# Altium project 4th_4G.PrjPcb
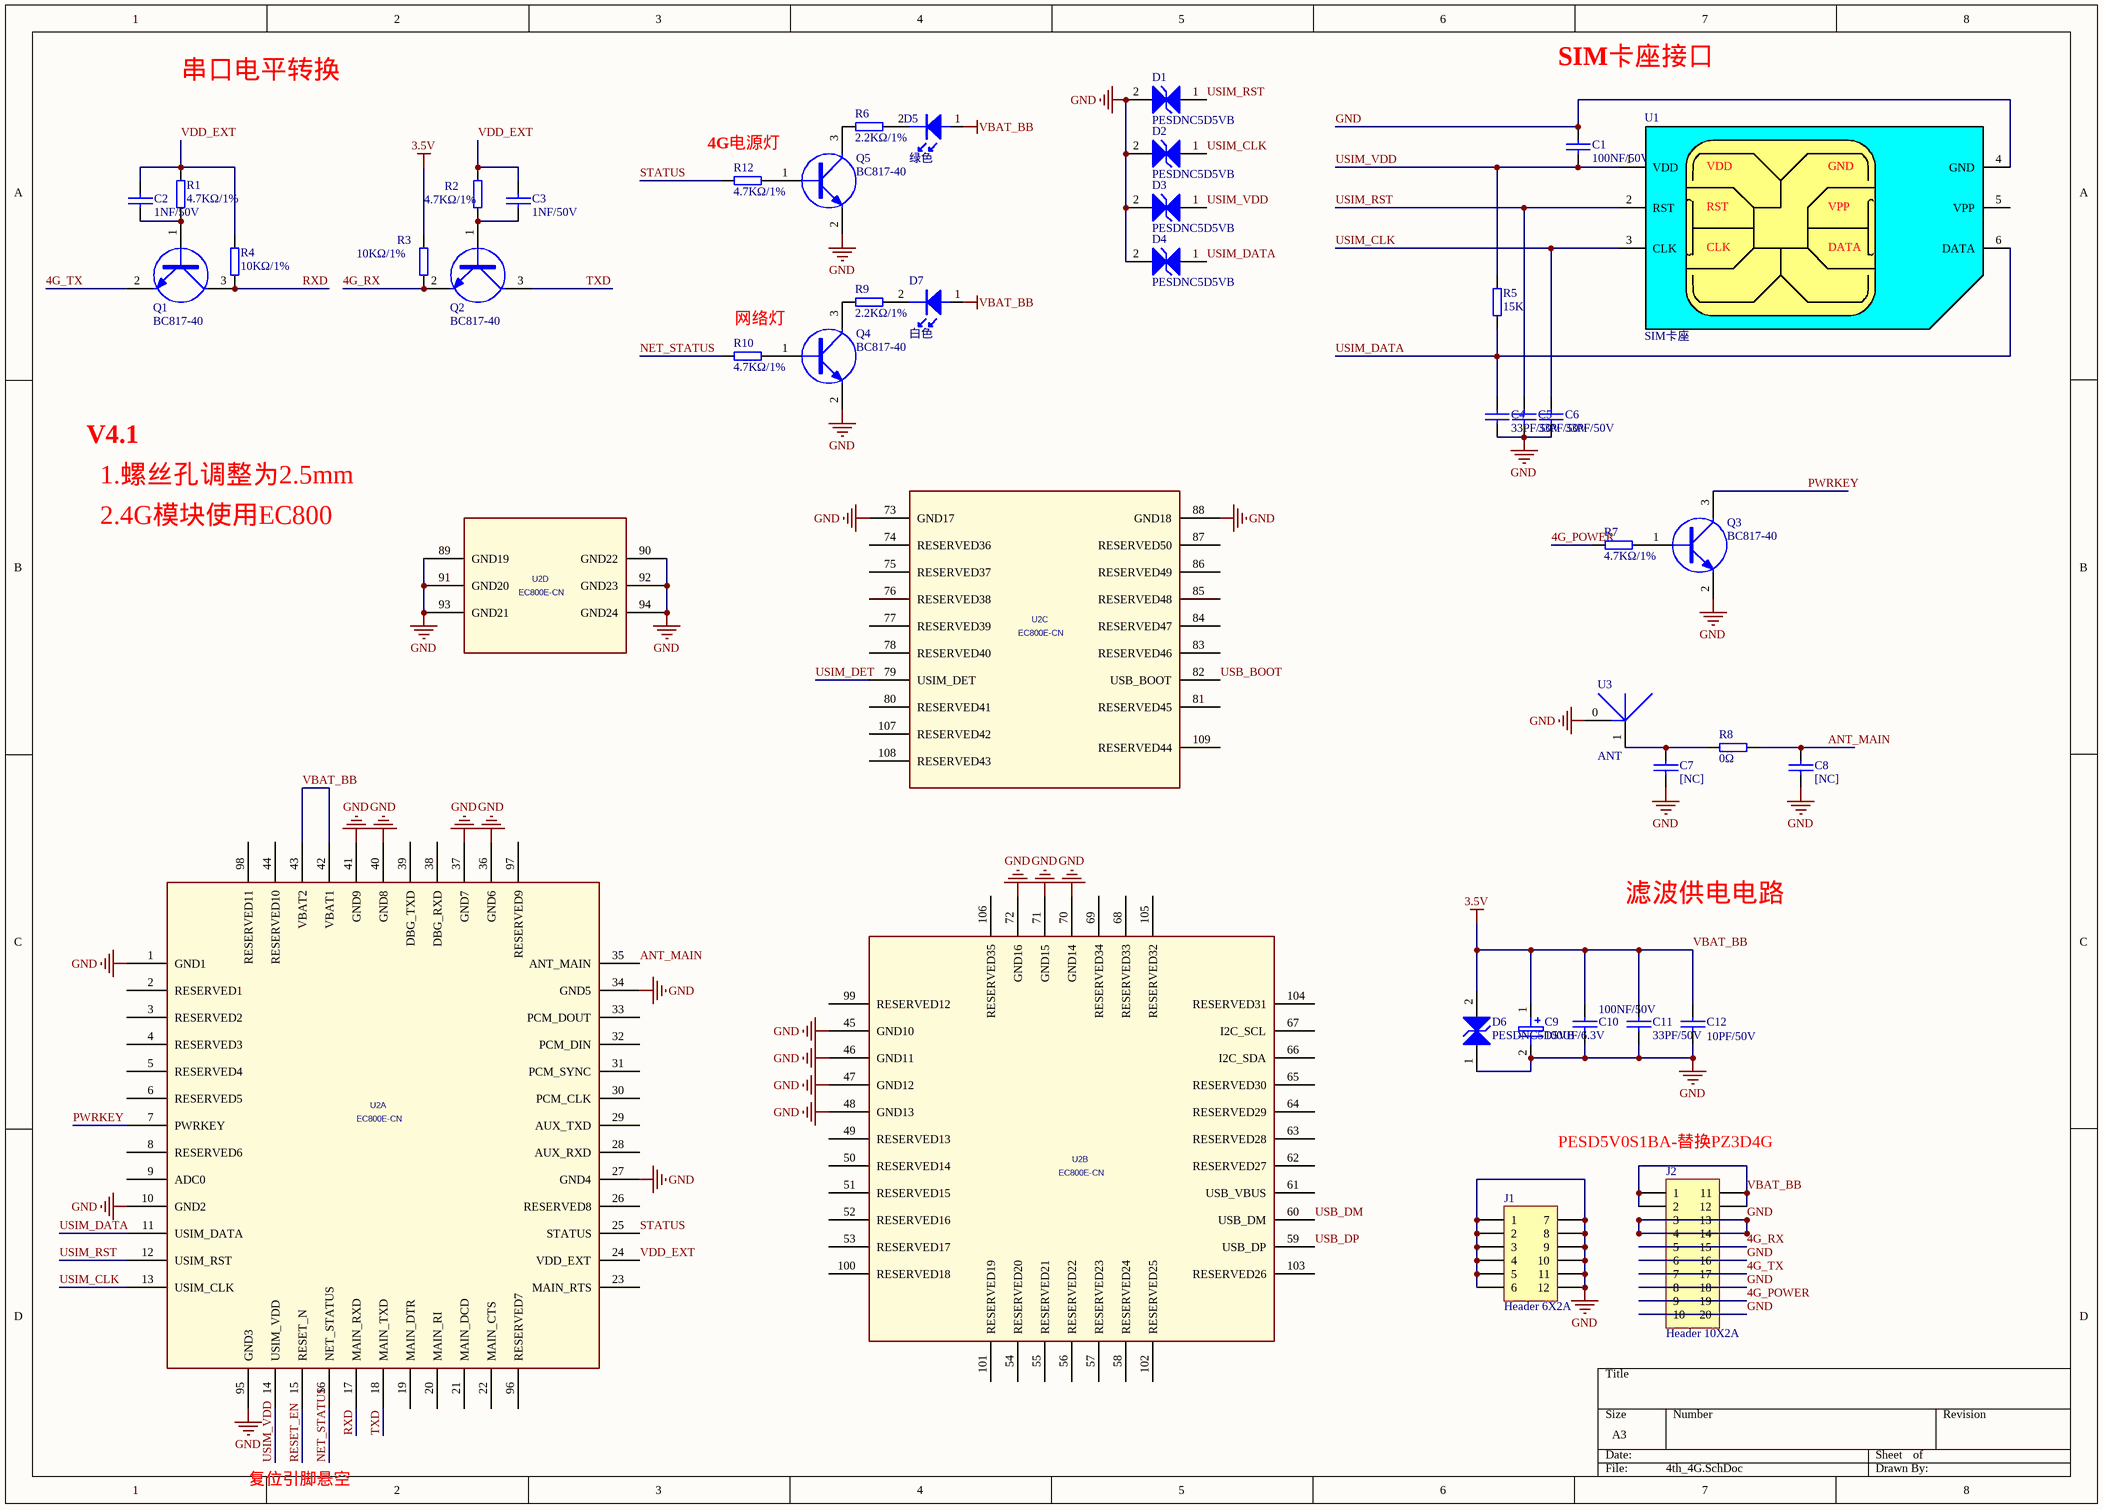
[diagram p0: 4th_4G.SchDoc]
1 sheet, 40 parts. Net scope: global (net labels, ports and power ports of the same name join across sheets).
Board file: 4th_4G.PcbDoc

## Sheet 4th_4G.SchDoc
size A3

### Parts
C1  100NF/50V  [0603_C]
C2  1NF/50V  [0603_C]
C3  1NF/50V  [0603_C]
C4  33PF/50V  [0603_C]
C5  33PF/50V  [0603_C]
C6  33PF/50V  [0603_C]
C7  [NC]  [0603_C]
C8  [NC]  [0603_C]
C9  100UF/6.3V  [CASE-B_3528]
C10  100NF/50V  [0603_C]
C11  33PF/50V  [0603_C]
C12  10PF/50V  [0603_C]
D1  PESDNC5D5VB  [SOD-523]
D2  PESDNC5D5VB  [SOD-523]
D3  PESDNC5D5VB  [SOD-523]
D4  PESDNC5D5VB  [SOD-523]
D5  绿色  [0603_D]
D6  PESDNC5D5VB  [SOD-523]
D7  白色  [0603_D]
J1  Header 6X2A  [HDR2X6_CEN]
J2  Header 10X2A  [HDR2X10_CEN]
Q1  BC817-40  [SOT-23-3]
Q2  BC817-40  [SOT-23-3]
Q3  BC817-40  [SOT-23-3]
Q4  BC817-40  [SOT-23-3]
Q5  BC817-40  [SOT-23-3]
R1  4.7KΩ/1%  [0603_R]
R2  4.7KΩ/1%  [0603_R]
R3  10KΩ/1%  [0603_R]
R4  10KΩ/1%  [0603_R]
R5  15K  [0603_R]
R6  2.2KΩ/1%  [0603_R]
R7  4.7KΩ/1%  [0603_R]
R8  0Ω  [0603_R]
R9  2.2KΩ/1%  [0603_R]
R10  4.7KΩ/1%  [0603_R]
R12  4.7KΩ/1%  [0603_R]
U1  SIM卡座  [SIM卡座-NANO掀盖式]
U2  EC800E-CN  [EC800E-CN]  (parts A,B,C,D of 4)
U3  ANT  [SMA-KWE/弯头]

### Nets
GND: C1.1 C4.2 C5.2 C6.2 C7.2 C8.2 C9.2 C10.2 C11.2 C12.2 D1.2(K) D2.2(K) D3.2(K) D4.2(K) D6.1 J1.1 J1.2 J1.3 J1.4 J1.5 J1.6 J1.7 J1.8 J1.9 J1.10 J1.11 J1.12 J2.3 J2.4 J2.6 J2.8 J2.10 J2.13 J2.14 J2.16 J2.18 J2.20 Q3.2 Q4.2 Q5.2 U1.4(GND) U2.1(GND1) U2.10(GND2) U2.27(GND4) U2.34(GND5) U2.36(GND6) U2.37(GND7) U2.40(GND8) U2.41(GND9) U2.45(GND10) U2.46(GND11) U2.47(GND12) U2.48(GND13) U2.70(GND14) U2.71(GND15) U2.72(GND16) U2.73(GND17) U2.88(GND18) U2.89(GND19) U2.90(GND22) U2.91(GND20) U2.92(GND23) U2.93(GND21) U2.94(GND24) U2.95(GND3) U3.0
VBAT_BB: C9.1 C10.1 C11.1 C12.1 D5.1 D6.2(K) D7.1 J2.1 J2.2 J2.11 J2.12 R3.2 U2.42(VBAT1) U2.43(VBAT2)  [also labelled 3.5V]
4G_POWER: J2.9 J2.19 R7.1
4G_RX: J2.5 J2.15 Q2.2 R3.1
4G_TX: J2.7 J2.17 Q1.2
ANT_MAIN: C8.1 R8.2 U2.35(ANT_MAIN)
NET_STATUS: R10.1 U2.16(NET_STATUS)
PWRKEY: Q3.3 U2.7(PWRKEY)
RESET_EN: U2.15(RESET_N)
RXD: Q1.3 R4.1 U2.17(MAIN_RXD)
STATUS: R12.1 U2.25(STATUS)
TXD: Q2.3 U2.18(MAIN_TXD)
USB_BOOT: U2.82(USB_BOOT)
USB_DM: U2.60(USB_DM)
USB_DP: U2.59(USB_DP)
USIM_CLK: C6.1 D2.1 U1.3(CLK) U2.13(USIM_CLK)
USIM_DATA: C4.1 D4.1 R5.1 U1.6(DATA) U2.11(USIM_DATA)
USIM_DET: U2.79(USIM_DET)
USIM_RST: C5.1 D1.1 U1.2(RST) U2.12(USIM_RST)
USIM_VDD: C1.2 D3.1 R5.2 U1.1(VDD) U2.14(USIM_VDD)
VDD_EXT: C2.1 C3.1 R1.2 R2.2 R4.2 U2.24(VDD_EXT)
NetC2_2: C2.2 Q1.1 R1.1
NetC3_2: C3.2 Q2.1 R2.1
NetC7_1: C7.1 R8.1 U3.1
NetD5_2: D5.2 R6.1
NetD7_2: D7.2 R9.1
NetQ3_1: Q3.1 R7.2
NetQ4_1: Q4.1 R10.2
NetQ4_3: Q4.3 R9.2
NetQ5_1: Q5.1 R12.2
NetQ5_3: Q5.3 R6.2

Not connected (* = marked no-connect by the designer): U1 5(VPP); U2 2(RESERVED1) 3(RESERVED2) 4(RESERVED3) 5(RESERVED4) 6(RESERVED5) 8(RESERVED6) 9(ADC0) 19(MAIN_DTR) 20(MAIN_RI) 21(MAIN_DCD) 22(MAIN_CTS) 23(MAIN_RTS) 26(RESERVED8) 28(AUX_RXD) 29(AUX_TXD) 30(PCM_CLK) 31(PCM_SYNC) 32(PCM_DIN) 33(PCM_DOUT) 38(DBG_RXD) 39(DBG_TXD) 44(RESERVED10) 49(RESERVED13) 50(RESERVED14) 51(RESERVED15) 52(RESERVED16) 53(RESERVED17) 54(RESERVED20) 55(RESERVED21) 56(RESERVED22) 57(RESERVED23) 58(RESERVED24) 61(USB_VBUS) 62(RESERVED27) 63(RESERVED28) 64(RESERVED29) 65(RESERVED30) 66(I2C_SDA) 67(I2C_SCL) 68(RESERVED33) 69(RESERVED34) 74(RESERVED36) 75(RESERVED37) 76(RESERVED38) 77(RESERVED39) 78(RESERVED40) 80(RESERVED41) 81(RESERVED45) 83(RESERVED46) 84(RESERVED47) 85(RESERVED48) 86(RESERVED49) 87(RESERVED50) 96(RESERVED7) 97(RESERVED9) 98(RESERVED11) 99(RESERVED12) 100(RESERVED18) 101(RESERVED19) 102(RESERVED25) 103(RESERVED26) 104(RESERVED31) 105(RESERVED32) 106(RESERVED35) 107(RESERVED42) 108(RESERVED43) 109(RESERVED44)

### Notes on the sheet
- 串口电平转换
- SIM卡座接口
- (near R12) 4G电源灯
- 网络灯
- V4.1
- 1.螺丝孔调整为2.5mm
- 2.4G模块使用EC800
- 滤波供电电路
- (near J2) PESD5V0S1BA-替换PZ3D4G
- 复位引脚悬空

### Library data of the parts
C1-C8 C10-C12 = CAP: 无极性电容
C9 = CAP POLAR: 钽电容
D1-D4 D6 = TVS: TVS 瞬态抑制二极管; Published: 8-Jun-2000; LatestRevisionDate: 17-Jul-2002; LatestRevisionNote: Re-released for DXP Platform.; PackageReference: DIODE-0.7; Publisher: Altium Limited
D5 D7 = LED: 发光二极管
J1 = Header 6X2A: Header, 6-Pin, Dual row; LatestRevisionDate: 17-Jul-2002; LatestRevisionNote: Re-released for DXP Platform.; Publisher: Altium Limited
J2 = Header 10X2A: Header, 10-Pin, Dual row; LatestRevisionDate: 17-Jul-2002; LatestRevisionNote: Re-released for DXP Platform.; Publisher: Altium Limited
Q1 Q2 Q4 Q5 = S8050: NPN
Q3 = BC817-40: NPN三极管; Ic: 0.5A; Vceo: 45V; Vcbo: 50V; Vebo: 5V; Pc: 0.3W
R1-R10 R12 = RES2: 电阻
U1 = SIM卡座: 无保护引脚SIM卡座
U2 = EC800E-CN: EC800E-CN Module 109PIN 15.8x17.7mm H2.4mm RO; Manufacturer: Quectel; Geometry.Height: 2.4mm; Part Description: EC800E-CN Module 109PIN 15.8x17.7mm H2.4mm RO; Value: EC800E-CN
U3 = ANT: 天线座